# EAGLE design RQ2_supply (EAGLE 7.6.0)
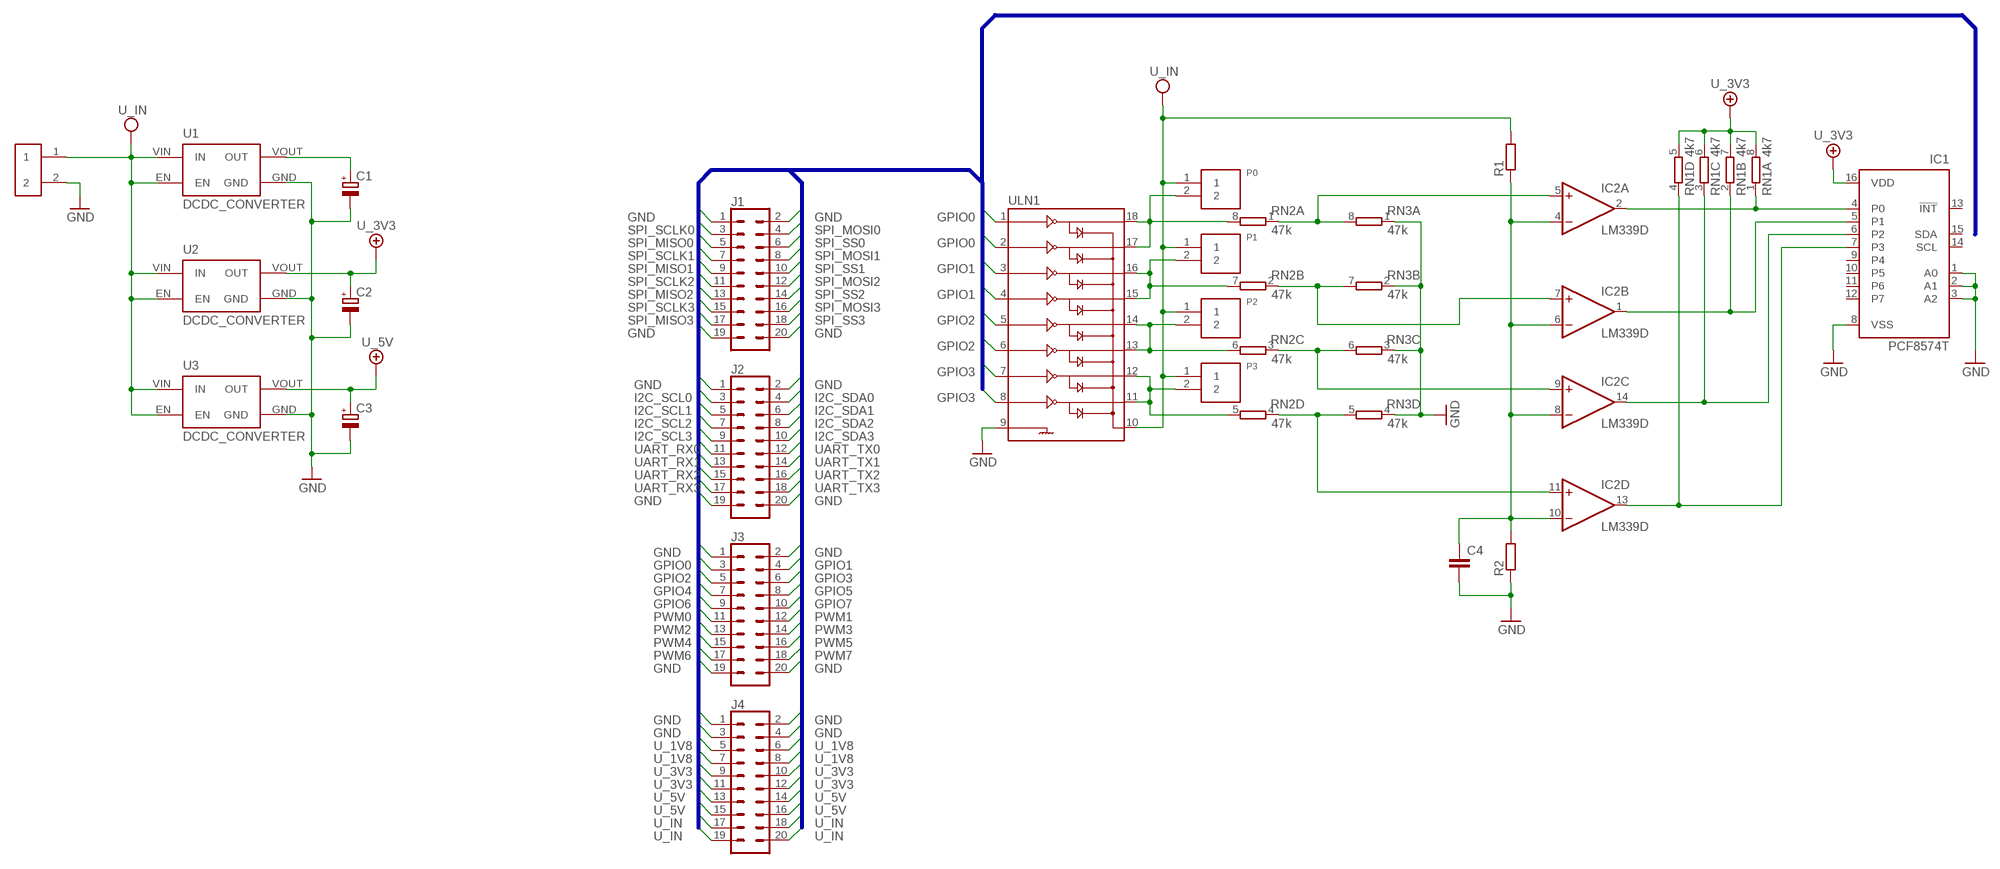
[diagram p0: schematic, sheet 1]

## Parts
C1  CPOL-EUC  [PANASONIC_C]
C2  CPOL-EUC  [PANASONIC_C]
C3  CPOL-EUC  [PANASONIC_C]
C4  C-EUC0805  [C0805]
IC1  PCF8574T  [SO16W]
IC2  LM339D  [SO14]
J1  CONN_10X2  [2X10]
J2  CONN_10X2  [2X10]
J3  CONN_10X2  [2X10]
J4  CONN_10X2  [2X10]
P0  2PIN  [B2B-PH-K-S]
P1  2PIN  [B2B-PH-K-S]
P2  2PIN  [B2B-PH-K-S]
P3  2PIN  [B2B-PH-K-S]
R1  R-EU_R0805  [R0805]
R2  R-EU_R0805  [R0805]
RN1  4k7  4R-N0603-ARV  [0603-ARV]
RN2  47k  4R-N0603-ARV  [0603-ARV]
RN3  47k  4R-N0603-ARV  [0603-ARV]
U1  DCDC_CONVERTER  [DCDC_CONVERTER]
U2  DCDC_CONVERTER  [DCDC_CONVERTER]
U3  DCDC_CONVERTER  [DCDC_CONVERTER]
U$1  XT_CONN  [XT30_PCB]
ULN1  ULN2803SOICW  [SO18L]

## Nets
GND: C1.- C2.- C3.- C4.2 IC1.1(A0) IC1.2(A1) IC1.3(A2) IC1.8(VSS) J1.1 J1.2 J1.19 J1.20 J2.1 J2.2 J2.19 J2.20 J3.1 J3.2 J3.19 J3.20 J4.1 J4.2 J4.3 J4.4 R2.1 RN3.1 RN3.2 RN3.3 RN3.4 U1.GND U2.GND U3.GND U$1.2 ULN1.9
GPIO0: J3.3 ULN1.1 ULN1.2
GPIO1: J3.4 ULN1.3 ULN1.4
GPIO2: J3.5 ULN1.5 ULN1.6
GPIO3: J3.6 ULN1.7 ULN1.8
GPIO4: J3.7
GPIO5: J3.8
GPIO6: J3.9
GPIO7: J3.10
I2C_SCL0: J2.3
I2C_SCL1: J2.5
I2C_SCL2: J2.7
I2C_SCL3: J2.9
I2C_SDA0: J2.4
I2C_SDA1: J2.6
I2C_SDA2: J2.8
I2C_SDA3: J2.10
N$7: IC1.4(P0) IC2.2(A:OUT) RN1.1
N$8: IC1.5(P1) IC2.1(B:OUT) RN1.2
N$9: IC1.6(P2) IC2.14(C:OUT) RN1.3
N$10: IC1.7(P3) IC2.13(D:OUT) RN1.4
N$11: IC2.5(A:+IN) RN2.1 RN3.8
N$12: IC2.7(B:+IN) RN2.2 RN3.7
N$13: IC2.9(C:+IN) RN2.3 RN3.6
N$14: IC2.11(D:+IN) RN2.4 RN3.5
N$15: C4.1 IC2.4(A:-IN) IC2.6(B:-IN) IC2.8(C:-IN) IC2.10(D:-IN) R1.1 R2.2
PWM0: J3.11
PWM1: J3.12
PWM2: J3.13
PWM3: J3.14
PWM4: J3.15
PWM5: J3.16
PWM6: J3.17
PWM7: J3.18
PYRO0: P0.2 RN2.8 ULN1.17 ULN1.18
PYRO1: P1.2 RN2.7 ULN1.15 ULN1.16
PYRO2: P2.2 RN2.6 ULN1.13 ULN1.14
PYRO3: P3.2 RN2.5 ULN1.11 ULN1.12
SPI_MISO0: J1.5
SPI_MISO1: J1.9
SPI_MISO2: J1.13
SPI_MISO3: J1.17
SPI_MOSI0: J1.4
SPI_MOSI1: J1.8
SPI_MOSI2: J1.12
SPI_MOSI3: J1.16
SPI_SCLK0: J1.3
SPI_SCLK1: J1.7
SPI_SCLK2: J1.11
SPI_SCLK3: J1.15
SPI_SS0: J1.6
SPI_SS1: J1.10
SPI_SS2: J1.14
SPI_SS3: J1.18
U_1V8: C1.+ J4.5 J4.6 J4.7 J4.8 U1.VOUT(OUT)
U_3V3: C2.+ IC1.16(VDD) J4.9 J4.10 J4.11 J4.12 RN1.5 RN1.6 RN1.7 RN1.8 U2.VOUT(OUT)
U_5V: C3.+ J4.13 J4.14 J4.15 J4.16 U3.VOUT(OUT)
U_IN: J4.17 J4.18 J4.19 J4.20 P0.1 P1.1 P2.1 P3.1 R1.2 U1.EN U1.VIN(IN) U2.EN U2.VIN(IN) U3.EN U3.VIN(IN) U$1.1 ULN1.10
UART_RX0: J2.11
UART_RX1: J2.13
UART_RX2: J2.15
UART_RX3: J2.17
UART_TX0: J2.12
UART_TX1: J2.14
UART_TX2: J2.16
UART_TX3: J2.18
Unconnected: IC1.9(P4) IC1.10(P5) IC1.11(P6) IC1.12(P7) IC1.13(!INT) IC1.14(SCL) IC1.15(SDA)

## Buses
SPI_SCLK[0..3],SPI_MOSI[0..3],SPI_MISO[0..3],SPI_SS[0..3],I2C_SCL[0..3],I2C_SDA[0..3],SD0_CLK,SD0_CMD,SD0_DAT[0..3],SD1_CLK,SD1_CMD,SD1_DAT[0..3],GPIO[0..7],ADC[0..7],PWM[0..7],UART_RX[0..3],UART_TX[0..3],RESET_N,XIN,XOUT,U_1V8,U_3V3,U_5V,U_IN,GND

## Power pins joined to a net without a drawn wire
GND: IC2.12(P:GND)
V+: IC2.3(P:V+)

## Library data of the parts
C1-C3 = rcl:CPOL-EU: POLARIZED CAPACITOR, European symbol
C4 = rcl:C-EU: CAPACITOR, European symbol
IC1 = micro-philips:PCF8574: I2C-Bus Remote 8-bit I/O expander http://www.semiconductors.philips.com/acrobat_download/datasheets/PCF8574_4.pdf; MPN: PCF8574T/3,512; OC_FARNELL: 1201255; OC_NEWARK: 70R6870
IC2 = linear:LM339: Low Power Low Offset Voltage Quad Comparators with open collector; LM139/LM239/LM339/LM2901/LM3302
J1-J4 = SparkFun-Connectors:CONN_10X2: Multi connection point. Often used as Generic Header-pin footprint for 0.1 inch spaced/style header connections On any of the 0.1 inch spaced packages, you can populate with these: Break Away Headers - Straight <https://www.sparkfun.com/products/116> (PRT-00116) Break Away Male Headers - Right Angle <https://www.sparkfun.com/products/553> (PRT-00553) Female Headers <https://www.sparkfun.com/products/115> (PRT-00115) Break Away Headers - Machine Pin <https://www.sparkfun.com/products/117> (PRT-00117) Break Away Female Headers - Swiss Machine Pin <https://www.sparkfun.com/products/743> (PRT-00743) Special note about the "SPECIAL" package: This was SPECIALLY designed to be used with our Graphic LCD Backpack. Be sure you want to use this! It is not only staggered on each line of header holes, but IT IS ALSO offset of the center point of the top and bottom lines by 5 mil. This causes the headers to lock into place on the "standard" footprint on the LCD screen. The extra squares on the tdocu layer are there simply to reference other pins (if you were to actually populate a longer header than ten long - this is what we do with the backpacks).
P0 P1-P3 = jst_eph:2PIN
R1 R2 = rcl:R-EU_: RESISTOR, European symbol
RN1-RN3 = resistor-dil:4R-N: Array Chip Resistor Source: RS Component / Phycomp; OC_FARNELL: unknown; OC_NEWARK: unknown
U1-U3 = arduino_modules:DCDC_CONVERTER
U$1 = SparkFun-Connectors:XT_CONN
ULN1 = SparkFun-IC-Special-Function:ULN2803: Darlington Driver(IC-07959, low stock) ULN2803 Darlington array. 500mA max per channel, 8-channel package. Spark Fun Electronics SKU : COM-00312

## Board
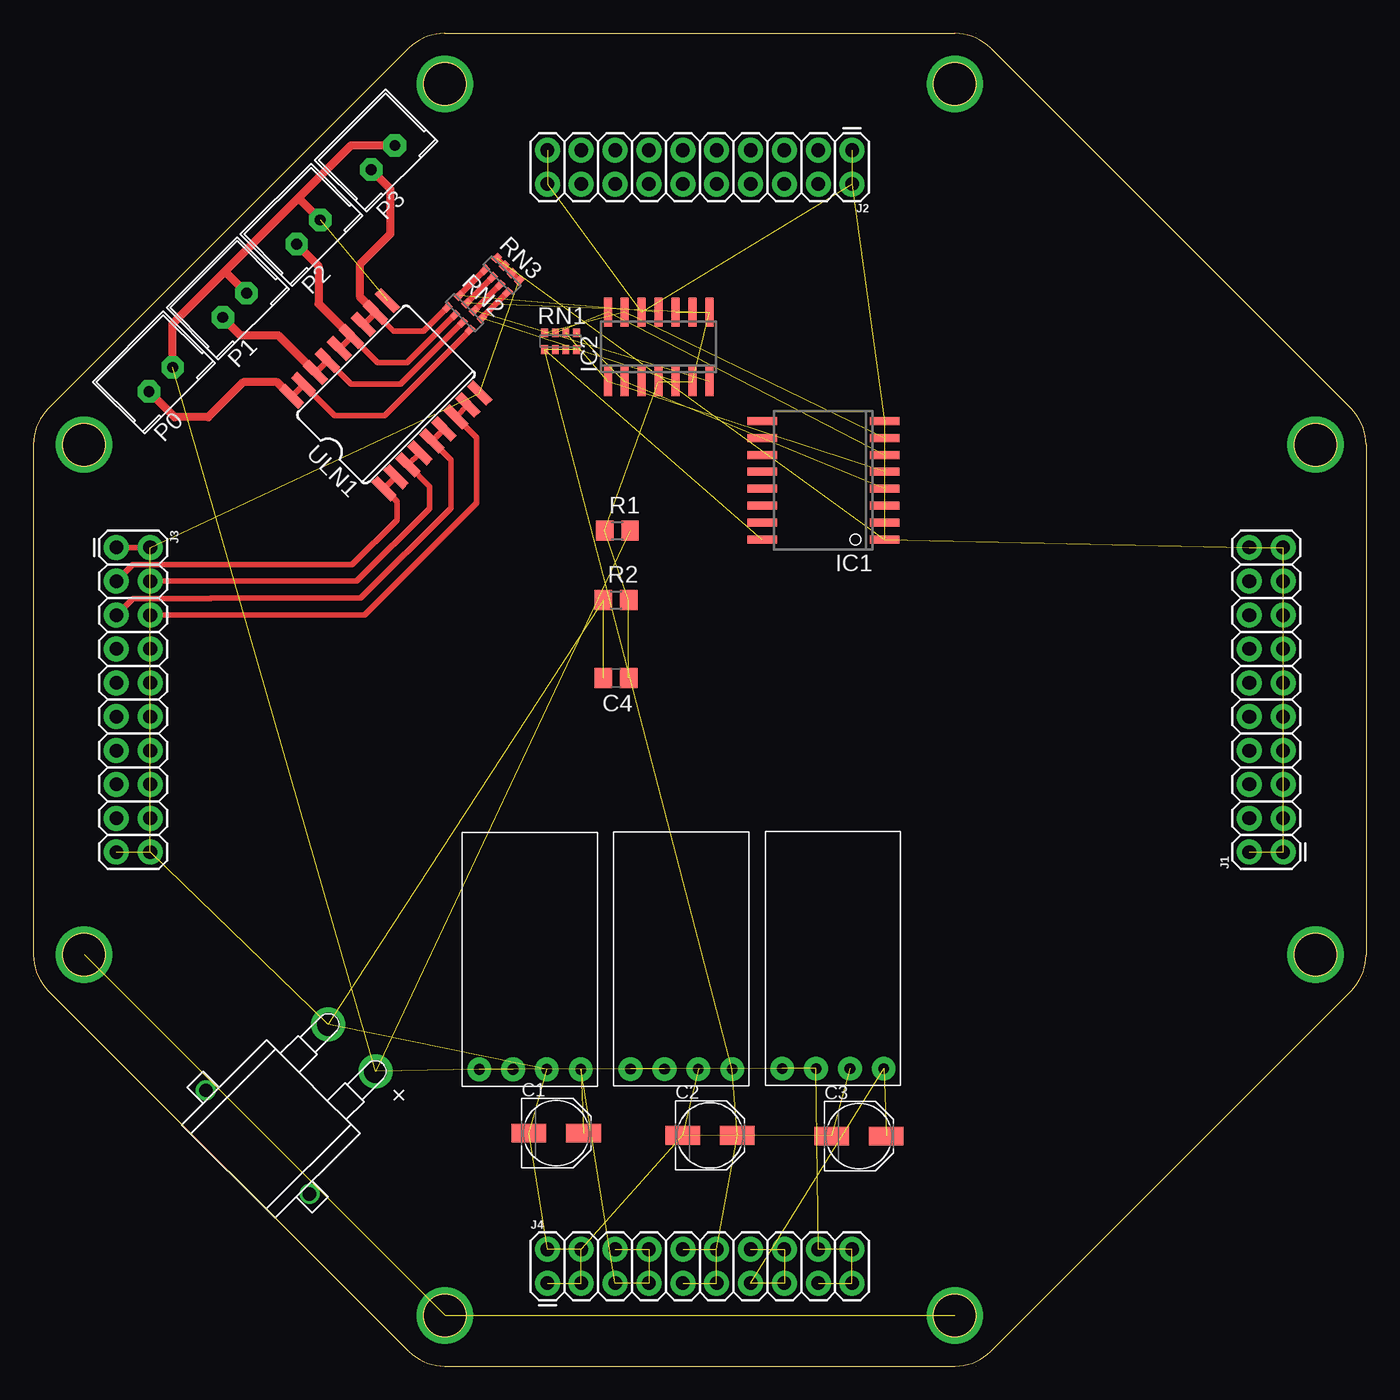
[diagram p1: board, top side]
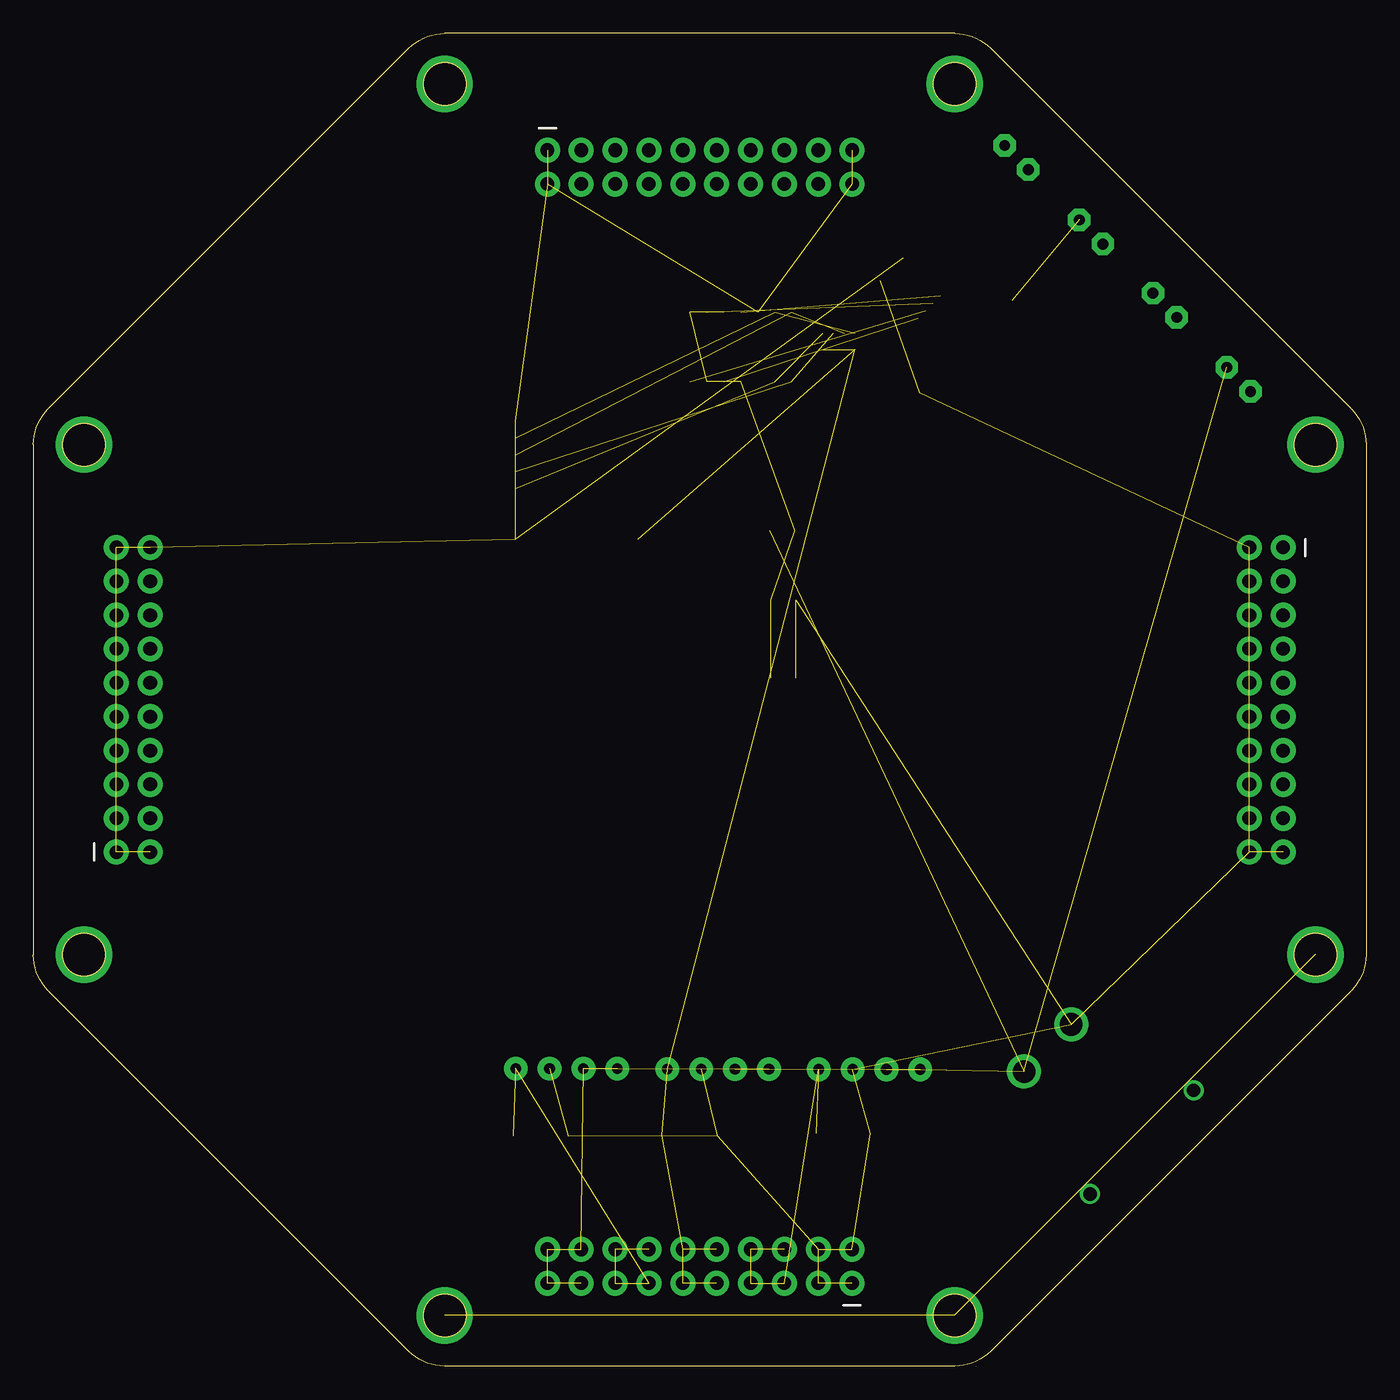
[diagram p2: board, bottom side, seen from below]

Size 100 x 100 mm. Coordinates in mm from the lower left corner, seen from the top.
Outline: 100,70.71 100,70.71
Outline: 100,29.29 100,29.29
Outline: 29.29,100 29.29,100
Outline: 70.71,100 70.71,100
Outline: 100,29.29 100,29.29
Outline: 70.71,0 70.71,0
Outline: 70.71,100 70.71,100
Outline: 100,70.71 100,70.71
Outline: 0,70.71 0,70.71
Outline: 26.36,97.07 26.36,97.07
Outline: 2.93,73.64 2.93,73.64
Outline: 29.29,100 29.29,100
Outline: 29.29,0 29.29,0
Outline: 2.93,26.36 2.93,26.36
Outline: 0,29.29 0,29.29
Outline: 0,70.71 0,70.71
Outline: 26.36,2.93 26.36,2.93
Outline: 0,29.29 0,29.29
Outline: 70.71,0 70.71,0
Outline: 29.29,0 29.29,0
Outline: 1.12,71.83 arc45 0,69.14 0,30.87 arc45 1.12,28.17 28.18,1.12 arc45 30.87,0 69.14,0 arc45 71.83,1.12 98.89,28.17 arc45 100,30.87 100,69.13 arc45 98.89,71.83 71.83,98.89 arc45 69.13,100 30.87,100 arc45 28.18,98.89 1.12,71.83
Outline: circle at 3.81,69.14 radius 1.6
Outline: circle at 3.81,30.87 radius 1.6
Outline: circle at 30.87,3.81 radius 1.6
Outline: circle at 69.14,3.81 radius 1.6
Outline: circle at 96.19,30.87 radius 1.6
Outline: circle at 96.19,69.13 radius 1.6
Outline: circle at 69.13,96.19 radius 1.6
Outline: circle at 30.87,96.19 radius 1.6
Copper layers (1*16): Top 0.035mm / dielectric 1.5mm / Bottom 0.035mm
Design rules "default": minimum track width 10mil, minimum drill 24mil, track to track 8mil, track to pad 8mil, pad to pad 8mil, via to via 8mil, smd to smd 8mil, copper to edge 40mil, drill to drill 8mil, minimum pad ring 10mil, minimum via ring 8mil, stop-mask expansion 4mil, vias tented up to drill 0mil, thermal gap 10mil

### Footprints (pad centres in the part's own frame; a part is rotated, then mirrored left to right if it is on the bottom)
PANASONIC_C = smd 2.6 x 1.4: + 2.05,0; - -2.05,0
C0805 = smd 1.3 x 1.5: 1 -0.95,0; 2 0.95,0
SO16W = smd 0.6 x 2.2: 1 -4.445,-4.6; 2 -3.175,-4.6; 3 -1.905,-4.6; 4 -0.635,-4.6; 5 0.635,-4.6; 6 1.905,-4.6; 7 3.175,-4.6; 8 4.445,-4.6; 9 4.445,4.6; 10 3.175,4.6; 11 1.905,4.6; 12 0.635,4.6; 13 -0.635,4.6; 14 -1.905,4.6; 15 -3.175,4.6; 16 -4.445,4.6
SO14 = smd 0.6 x 2.2: 1 -3.81,-2.6; 2 -2.54,-2.6; 3 -1.27,-2.6; 4 0,-2.6; 5 1.27,-2.6; 6 2.54,-2.6; 7 3.81,-2.6; 8 3.81,2.6; 9 2.54,2.6; 10 1.27,2.6; 11 0,2.6; 12 -1.27,2.6; 13 -2.54,2.6; 14 -3.81,2.6
2X10 = drill 1.016 pad 1.88: 1 0,0; 2 0,2.54; 3 2.54,0; 4 2.54,2.54; 5 5.08,0; 6 5.08,2.54; 7 7.62,0; 8 7.62,2.54; 9 10.16,0; 10 10.16,2.54; 11 12.7,0; 12 12.7,2.54; 13 15.24,0; 14 15.24,2.54; 15 17.78,0; 16 17.78,2.54; 17 20.32,0; 18 20.32,2.54; 19 22.86,0; 20 22.86,2.54
B2B-PH-K-S = drill 0.813 pad 1.676 octagon: 1 1.27,0.025; 2 -1.27,0
R0805 = smd 1.3 x 1.5: 1 -0.95,0; 2 0.95,0
0603-ARV = smd 0.5 x 0.65: 1 -1.2,-0.625; 2 -0.4,-0.625; 3 0.4,-0.625; 4 1.2,-0.625; 5 1.2,0.625; 6 0.4,0.625; 7 -0.4,0.625; 8 -1.2,0.625
DCDC_CONVERTER = drill 0.8 pad 1.778: EN 0,-7.62; GND 0,-2.54; VIN 0,-5.08; VOUT 0,0
XT30_PCB = drill 1.7: 1 -2.5,0; 2 2.5,0 | drill 1: AUX1 -5.5,10; AUX2 5.5,10
SO18L = smd 0.66 x 2.032: 1 -0.635,-4.902; 2 0.635,-4.902; 3 1.905,-4.902; 4 3.175,-4.902; 5 4.445,-4.902; 6 5.715,-4.902; 7 6.985,-4.902; 8 8.255,-4.902; 9 9.525,-4.902; 10 9.525,4.902; 11 8.255,4.902; 12 6.985,4.902; 13 5.715,4.902; 14 4.445,4.902; 15 3.175,4.902; 16 1.905,4.902; 17 0.635,4.902; 18 -0.635,4.902

### Placement (x,y rotation side)
C1  39.23,17.49 0 top
C2  50.77,17.32 0 top
C3  61.95,17.27 0 top
C4  43.72,51.63 180 top
IC1  59.28,66.47 90 top
IC2  46.91,76.48 0 top
J1  93.77,38.57 90 top
J2  61.43,91.23 180 top
J3  6.23,61.43 270 top
J4  38.57,6.23 0 top
P0  9.58,74.03 45 top
P1  15.12,79.59 45 top
P2  20.65,85.09 45 top
P3  26.25,90.68 45 top
R1  43.82,62.68 0 top
R2  43.72,57.49 0 top
RN1  39.56,76.89 180 top
RN2  32.36,79.04 135 top
RN3  35.17,81.86 135 top
U1  41.08,22.27 270 top
U2  52.43,22.29 270 top
U3  63.81,22.33 270 top
U$1  23.9,23.88 135 top
ULN1  23.3,69.75 45 top

### Tracks (layer width: path | path; a pad name or v marks a point on that pad's centre or on a via)
GND  (30 unrouted)
  Top 0.406: J3.1 J3.2 | RN3.1 RN3.2 RN3.3 RN3.4
GPIO0
  Top 0.406: J3.3 6.22,58.89 7.47,60.15 23.93,60.15 27.28,63.5 27.28,64.86 ULN1.1 ULN1.2
GPIO1
  Top 0.406: J3.4 24.27,58.89 29.74,64.36 29.74,66 ULN1.3 ULN1.4
GPIO2
  Top 0.406: ULN1.5 31.35,67.98 31.35,64.4 24.56,57.62 13.33,57.62 13.32,57.61 7.5,57.61 J3.5 | ULN1.5 | ULN1.5 ULN1.6
GPIO3
  Top 0.406: J3.6 24.84,56.35 33.27,64.78 33.27,69.65 ULN1.7 | ULN1.7 | ULN1.7 ULN1.8
N$1  (via drill 3.2)
  other vias: 69.14,96.2
N$2  (via drill 3.2)
  other vias: 30.88,96.2
N$3  (via drill 3.2)  (2 unrouted)
  other vias: 30.88,3.8 3.8,30.88 69.14,3.8
N$4  (via drill 3.2)
  other vias: 96.2,30.88
N$5  (via drill 3.2)
  other vias: 96.2,69.14
N$6  (via drill 3.2)
  other vias: 3.8,69.14
N$7  (2 unrouted)
N$8  (2 unrouted)
N$9  (2 unrouted)
N$10  (2 unrouted)
N$11  (1 unrouted)
  Top 0.406: RN2.1 RN3.8
N$12  (1 unrouted)
  Top 0.406: RN2.2 RN3.7
N$13  (1 unrouted)
  Top 0.406: RN2.3 RN3.6
N$14  (1 unrouted)
  Top 0.406: RN2.4 RN3.5
N$15  (6 unrouted)
PYRO0
  Top 0.406: ULN1.17 22.61,71.33 26.34,71.33 RN2.8
  Top 0.5: ULN1.17 ULN1.18
  Top 0.6: ULN1.18 18.31,73.83 15.75,73.83 13.13,71.21 10.6,71.21 P0.2
PYRO1
  Top 0.406: ULN1.15 23.86,73.68 27.56,73.68 RN2.7
  Top 0.5: ULN1.15 ULN1.16
  Top 0.6: ULN1.16 18.4,77.34 15.57,77.34 P1.2
PYRO2
  Top 0.406: ULN1.13 25.84,75.28 28.03,75.28 RN2.6 | ULN1.14
  Top 0.5: ULN1.14 ULN1.13
  Top 0.6: P2.2 21.41,82.54 21.41,79.72 ULN1.13
PYRO3
  Top 0.406: RN2.5 29.28,77.67 27.05,77.67 ULN1.11 | ULN1.12
  Top 0.5: ULN1.12 ULN1.11
  Top 0.6: ULN1.11 24.52,80.19 24.52,82.67 26.81,84.96 26.81,88.32 P3.2
U_1V8  (5 unrouted)
U_3V3  (10 unrouted)
U_5V  (5 unrouted)
U_IN  (13 unrouted)
  Top 0.6: P0.1 10.46,78.22 14.42,82.18 | 14.42,82.18 19.88,87.64 | 19.88,87.64 23.83,91.59 P3.1 | P1.1 14.42,82.08 14.42,82.18 | P2.1 19.89,87.64 19.88,87.64